# EAGLE design e-ink-clock (EAGLE 9.3.1)
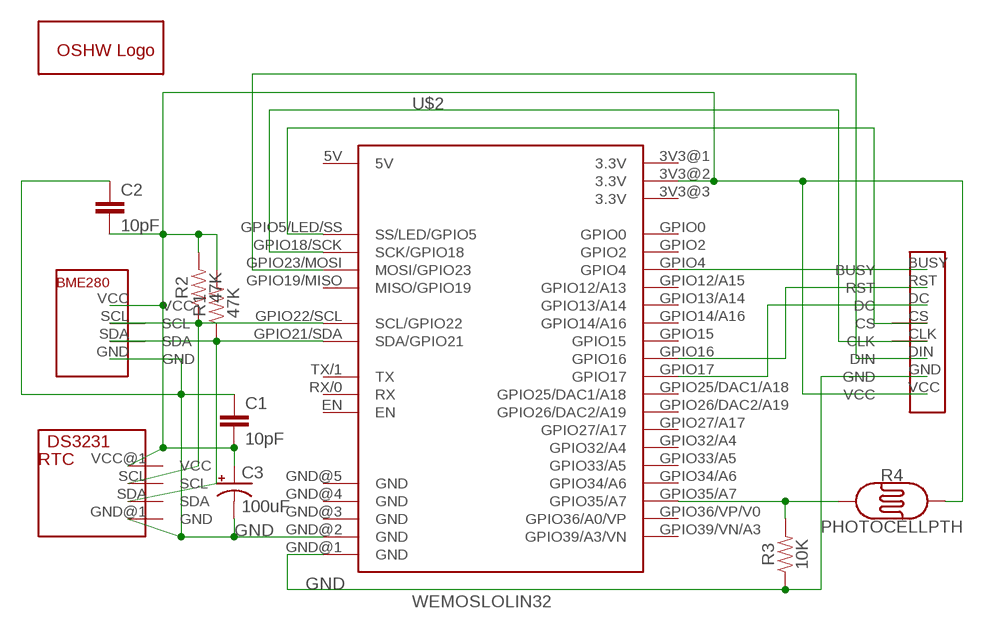
[diagram p0: schematic, sheet 1]

## Parts
C1  10pF  CAPPTH2  [CAP-PTH-SMALL2]
C2  10pF  CAPPTH2  [CAP-PTH-SMALL2]
C3  100uF  100UF-POLAR-RADIAL-2.5MM-25V-20%  [CPOL-RADIAL-2.5MM-6.5MM]
GOLD_ORB_SM1  OSHWLOGOLOGO16MM  [OSHW_16MM]
R1  47K  RESISTORAXIAL-0.3  [AXIAL-0.3]
R2  47K  RESISTORAXIAL-0.3  [AXIAL-0.3]
R3  10K  RESISTORAXIAL-0.3  [AXIAL-0.3]
R4  PHOTOCELLPTH  [PHOTOCELL]
U$1  WAVESHAREE-INK  [WAVESHARE-EINK]
U$2  WEMOSLOLIN32  [LOLIN32VAR1]
U$3  BME280BREAKOUTBME280  [HDRV4W64P254_1X4_1016X508X838B]
U$4  DS3231BREAKOUT  [DS3231BREAKOUT]

## Nets
3.3V: C1.2 C2.2 C3.1(+) R1.P$2 R2.P$2 R4.2 U$1.VCC U$2.3V3@2(3.3V) U$3.VCC U$4.VCC@1(VCC)
GND: C1.1 C2.1 C3.2(-) R3.P$1 U$1.GND U$2.GND@1(GND) U$2.GND@2(GND) U$3.GND U$4.GND@1(GND)
N$1: U$1.CLK U$2.GPIO18/SCK(SCK/GPIO18)
N$2: U$1.CS U$2.GPIO5/LED/SS(SS/LED/GPIO5)
N$5: R2.P$1 U$2.GPIO22/SCL(SCL/GPIO22) U$3.SCL U$4.SCL
N$6: R1.P$1 U$2.GPIO21/SDA(SDA/GPIO21) U$3.SDA U$4.SDA
N$7: U$1.BUSY U$2.GPIO4
N$8: U$1.RST U$2.GPIO16
N$10: U$1.DC U$2.GPIO17
N$11: U$1.DIN U$2.GPIO23/MOSI(MOSI/GPIO23)
N$12: R3.P$2 R4.1 U$2.GPIO35/A7
Unconnected: U$2.3V3@1(3.3V) U$2.EN U$2.GND@3(GND) U$2.GND@4(GND) U$2.GND@5(GND) U$2.GPIO0 U$2.GPIO2 U$2.GPIO12/A15(GPIO12/A13) U$2.GPIO13/A14 U$2.GPIO14/A16 U$2.GPIO15 U$2.GPIO19/MISO(MISO/GPIO19) U$2.GPIO25/DAC1/A18 U$2.GPIO26/DAC2/A19 U$2.GPIO27/A17 U$2.GPIO32/A4 U$2.GPIO33/A5 U$2.GPIO34/A6 U$2.GPIO36/VP/V0(GPIO36/A0/VP) U$2.GPIO39/VN/A3(GPIO39/A3/VN) U$2.RX/0(RX) U$2.TX/1(TX)

## Power pins joined to a net without a drawn wire
3.3V: U$2.3V3@3(3.3V)
5V: U$2.5V

## Library data of the parts
C1 C2 = SparkFun:CAP: Capacitor Standard 0603 ceramic capacitor, and 0.1" leaded capacitor.
C3 = SparkFun-Capacitors:100UF-POLAR: 100µF polarized capacitors A capacitor is a passive two-terminal electrical component used to store electrical energy temporarily in an electric field.; PROD_ID: CAP-08439
GOLD_ORB_SM1 = oshw:OSHWLOGO: The OSHW logo for PCB layout
R1-R3 = SparkFun-Resistors:RESISTOR: Generic Resistor Package
R4 = SparkFun-Sensors:PHOTOCELL: Photocell (Photodetector, Photo Resistor, CdS) This is a very small light sensor. A photocell changes (also called a photodetector, photo resistor, CdS or photoconductive cell) resistance depending on the amount of light it is exposed to. These little sensors make great ambient light triggers (when light in the room turns on, do something). Datasheet <http://cdn.sparkfun.com/datasheets/Sensors/LightImaging/SEN-09088.pdf> SparkFun Products Mini Photocell <https://www.sparkfun.com/products/9088> (SEN-09088); PROD_ID: COMP-09129; SF_ID: SEN-09088
U$1 = LOLIN32:WAVESHAREE-INK: Waveshare epaper/e-ink SPI module connector
U$2 = LOLIN32:WEMOSLOLIN32: WEMOS LOLIN32 CPU with Wifi and 4Gb flash storage
U$3 = LOLIN32:BME280BREAKOUT
U$4 = LOLIN32:DS3231BREAKOUT

## Board
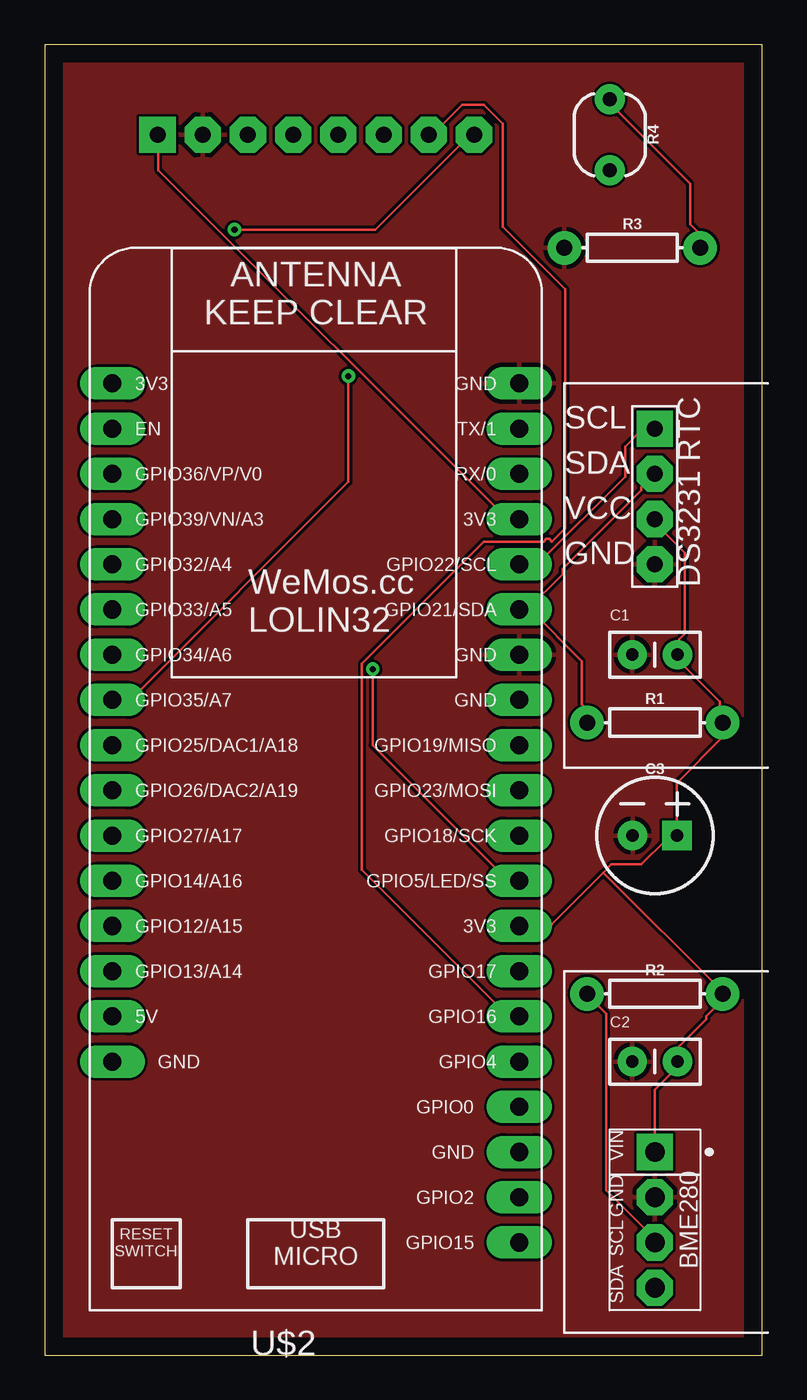
[diagram p1: board, top side]
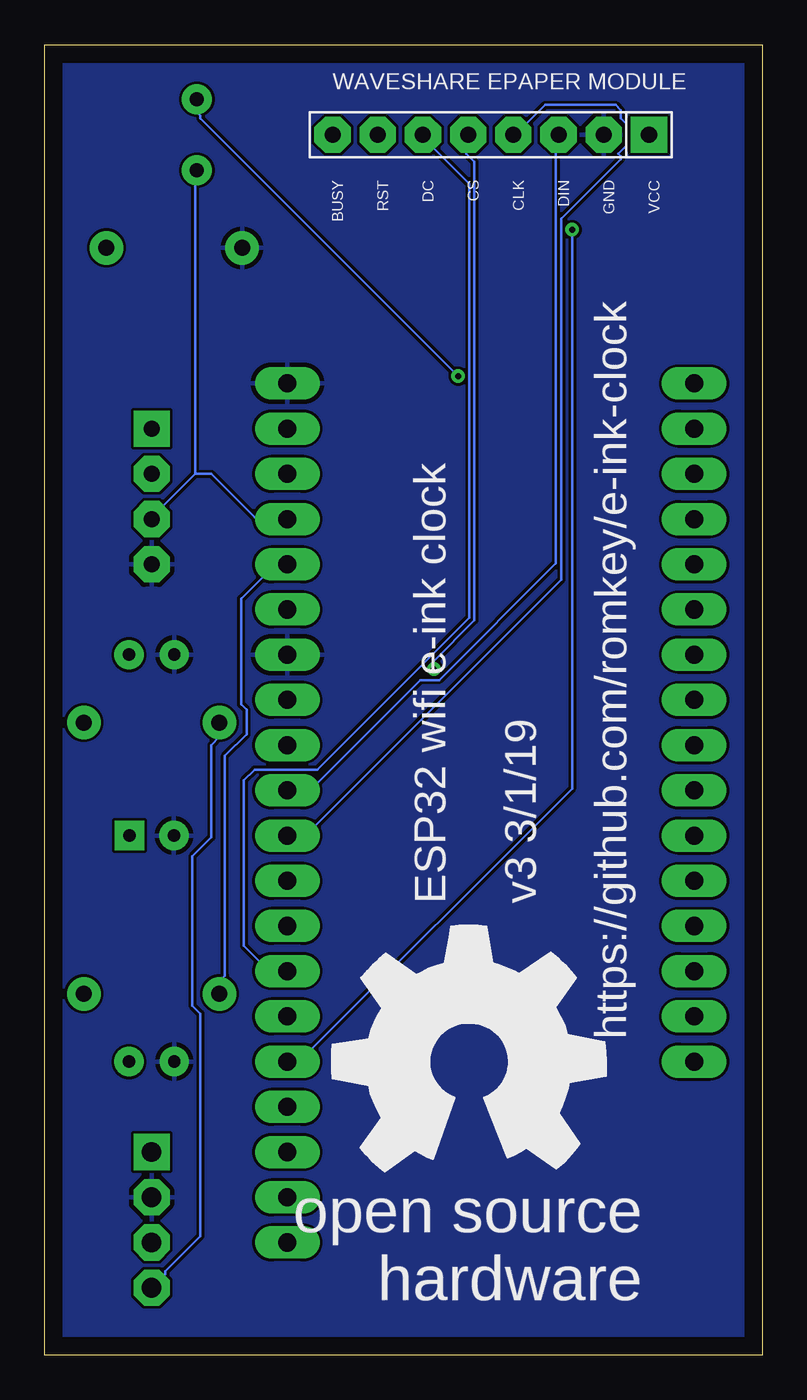
[diagram p2: board, bottom side, seen from below]

Size 40.31 x 73.65 mm. Coordinates in mm from the lower left corner, seen from the top.
Outline: 0,0 40.31,0 40.31,73.65 0,73.65 0,0
Copper layers (1*16): Top 0.035mm / dielectric 1.5mm / Bottom 0.035mm
Design rules "default": minimum track width 6mil, minimum drill 0.35mm, track to track 6mil, track to pad 6mil, pad to pad 6mil, via to via 6mil, smd to smd 6mil, copper to edge 40mil, drill to drill 6mil, minimum pad ring 10mil, minimum via ring 8mil, stop-mask expansion 4mil, vias tented up to drill 0mil, thermal gap 10mil

### Footprints (pad centres in the part's own frame; a part is rotated, then mirrored left to right if it is on the bottom)
CAP-PTH-SMALL2 = drill 0.7 pad 1.651: 1 0,0; 2 2.54,0
CPOL-RADIAL-2.5MM-6.5MM = drill 0.7 pad 1.651 square: 1 1.25,0 | drill 0.7 pad 1.651: 2 -1.25,0
AXIAL-0.3 = drill 0.9 pad 1.88: P$1 -3.81,0; P$2 3.81,0
PHOTOCELL = drill 0.8 pad 1.676: 1 -2,0; 2 2,0
WAVESHARE-EINK = drill 0.9 pad 2.032 octagon: BUSY -15.24,-7.62; CLK -15.24,2.54; CS -15.24,0; DC -15.24,-2.54; DIN -15.24,5.08; GND -15.24,7.62; RST -15.24,-5.08 | drill 0.9 pad 2.032 square: VCC -15.24,10.16
LOLIN32VAR1 = drill 1.016 pad 1.829 long: 3V3@1 -11.43,24.13; 3V3@2 11.43,16.51; 3V3@3 11.43,-6.35; 5V -11.43,-11.43; EN -11.43,21.59; GND@1 11.43,24.13; GND@2 11.43,8.89; GND@3 11.43,6.35; GND@4 11.43,-19.05; GND@5 -11.43,-13.97; GPIO0 11.43,-16.51; GPIO2 11.43,-21.59; GPIO4 11.43,-13.97; GPIO5/LED/SS 11.43,-3.81; GPIO12/A15 -11.43,-6.35; GPIO13/A14 -11.43,-8.89; GPIO14/A16 -11.43,-3.81; GPIO15 11.43,-24.13; GPIO16 11.43,-11.43; GPIO17 11.43,-8.89; GPIO18/SCK 11.43,-1.27; GPIO19/MISO 11.43,3.81; GPIO21/SDA 11.43,11.43; GPIO22/SCL 11.43,13.97; GPIO23/MOSI 11.43,1.27; GPIO25/DAC1/A18 -11.43,3.81; GPIO26/DAC2/A19 -11.43,1.27; GPIO27/A17 -11.43,-1.27; GPIO32/A4 -11.43,13.97; GPIO33/A5 -11.43,11.43; GPIO34/A6 -11.43,8.89; GPIO35/A7 -11.43,6.35; GPIO36/VP/V0 -11.43,19.05; GPIO39/VN/A3 -11.43,16.51; RX/0 11.43,19.05; TX/1 11.43,21.59
HDRV4W64P254_1X4_1016X508X838B = drill 1.105 pad 2.032 octagon: GND 2.54,0; SCL 5.08,0; SDA 7.62,0 | drill 1.105 pad 2.032 square: VCC 0,0
DS3231BREAKOUT = drill 0.9 pad 2.032 octagon: GND@1 5.08,2.54; SDA 5.08,7.62; VCC@1 5.08,5.08 | drill 0.9 pad 2.032 square: SCL 5.08,10.16

### Placement (x,y rotation side)
C1  33.02,39.37 0 top
C2  33.02,16.51 0 top
C3  34.29,29.21 0 top
GOLD_ORB_SM1  16.51,16.51 0 bottom
R1  34.29,35.56 0 top
R2  34.29,20.32 0 top
R3  33.02,62.23 0 top
R4  31.75,68.58 270 top
U$1  16.51,53.34 270 bottom
U$2  15.24,30.48 0 top
U$3  34.29,11.43 270 top
U$4  29.21,41.91 0 top

### Tracks (layer width: path | path; a pad name or v marks a point on that pad's centre or on a via)
3.3V
  Top 0.152: U$3.VCC 34.29,14.94 35.51,16.15 35.51,16.46 C2.2 35.66,16.61 35.66,17.37 37.19,18.9 37.19,19.05 38.1,19.96 R2.P$2 38.1,20.42 31.39,27.13 | 35.51,29.26 35.51,32.16 38.1,34.75 R1.P$2 38.1,35.66 37.95,35.81 37.95,36.73 35.66,39.01 35.66,39.32 C1.2 35.66,39.47 35.66,40.23 35.97,40.54 35.97,45.11 34.29,46.79 U$4.VCC@1 | 31.39,27.13 31.85,27.58 33.53,27.58 34.9,28.96 34.9,29.11 35.05,29.26 35.51,29.26 | 31.39,27.13 28.5,24.23 26.67,24.23 U$2.3V3@3 | 35.51,29.26 C3.1 | U$1.VCC 6.4,68.58 6.4,66.6 25.91,47.09 26.67,47.09 U$2.3V3@2
  Bottom 0.152: 31.85,49.53 31.85,66.45 R4.2 | 31.85,49.53 34.29,47.09 U$4.VCC@1 | 31.85,49.53 30.94,49.53 28.5,47.09 26.67,47.09 U$2.3V3@2
GND
  pour Top: 0,73.66 40.64,73.66 40.64,0 0,0
  pour Bottom: 0,73.66 40.64,73.66 40.64,0 0,0
N$1
  Bottom 0.152: U$2.GPIO18/SCK 26.67,29.26 25.6,29.26 11.28,43.59 11.28,63.86 7.92,67.21 7.92,67.36 8.08,67.51 7.62,67.97 7.62,69.19 7.92,69.49 7.92,69.95 8.23,70.26 12.19,70.26 13.87,68.58 U$1.CLK
N$2  (via drill 0.35)
  Top 0.152: U$2.GPIO5/LED/SS 26.06,26.67 18.44,34.29 v18.44,38.56
  Bottom 0.152: v18.44,38.56 18.44,39.01 16.15,41.3 16.15,67.06 16.61,67.51 16.61,68.58 U$1.CS
N$5
  Top 0.152: U$2.GPIO22/SCL 26.67,44.5 27.74,44.5 32.61,49.38 32.61,51.05 33.53,51.97 34.29,51.97 U$4.SCL | U$3.SCL 34.29,6.55 31.55,9.3 31.55,19.2 30.48,20.27 R2.P$1
  Bottom 0.152: R2.P$1 30.48,21.03 30.18,21.34 30.18,33.68 28.96,34.9 28.96,36.27 29.26,36.58 29.26,42.52 27.43,44.35 26.67,44.35 U$2.GPIO22/SCL
N$6
  Top 0.152: 27.13,41.91 27.28,41.91 30.18,39.01 30.18,36.58 30.48,36.27 R1.P$1 | U$4.SDA 33.53,48.77 33.53,48.62 29.11,44.2 29.11,43.89 27.13,41.91 | 27.13,41.91 U$2.GPIO21/SDA
  Bottom 0.152: U$3.SDA 33.53,4.57 33.53,4.72 31.55,6.71 31.55,19.2 32,19.66 32,28.04 30.94,29.11 30.94,34.29 30.48,34.75 R1.P$1
N$7  (via drill 0.35)
  Top 0.152: v10.67,63.25 18.59,63.25 23.93,68.58 U$1.BUSY
  Bottom 0.152: v10.67,63.25 10.67,31.85 25.91,16.61 26.67,16.61 U$2.GPIO4
N$8
  Top 0.152: U$2.GPIO16 26.06,19.05 17.83,27.28 17.83,38.86 24.69,45.72 28.04,45.72 28.19,45.87 28.35,45.87 28.5,45.72 29.26,46.48 29.26,59.89 25.76,63.4 25.76,69.19 24.69,70.26 23.47,70.26 21.79,68.58 U$1.RST
N$10
  Bottom 0.152: U$1.DC 19.05,68.43 16.46,65.84 16.46,41.45 24.99,32.92 28.5,32.92 29.11,32.31 29.11,23.01 27.74,21.64 26.67,21.64 U$2.GPIO17
N$11
  Bottom 0.152: U$1.DIN 11.58,68.43 11.58,44.5 18.14,37.95 19.2,37.95 25.3,31.85 26.67,31.85 U$2.GPIO23/MOSI
N$12  (via drill 0.35)
  Top 0.152: R4.1 31.85,70.56 31.85,70.26 36.27,65.84 36.27,63.55 36.73,63.09 36.73,62.33 R3.P$2 | v17.07,55.02 17.07,49.07 4.88,36.88 3.81,36.88 U$2.GPIO35/A7
  Bottom 0.152: v17.07,55.02 31.55,69.49 31.55,69.65 31.7,69.8 31.7,70.56 R4.1

### Text on the board
bPlace: v3 3/1/19 | ESP32 wifi e-ink clock | https://github.com/romkey/e-ink-clock